# Altium schematic sheet main.SchDoc
size 209 x 297 mm; Address1: Address1; Address2: Address2; Address3: Address3; Address4: Address4; SheetNumber: 1; SheetTotal: 1; Scale: 1:1; Разраб.: Михаил Каа; Обозначение документа: ZX_CARTRIDGE.002 Э3; Номер листа: 1; Общее количество листов: 1; Наименование организации: Михаил Каа; Наименование изделия 1: zx cartridge (Дельта); Наименование изделия 2: Схема электрическая; Наименование изделия 3: принципиальная; Нач. отд.: Нач. отд.
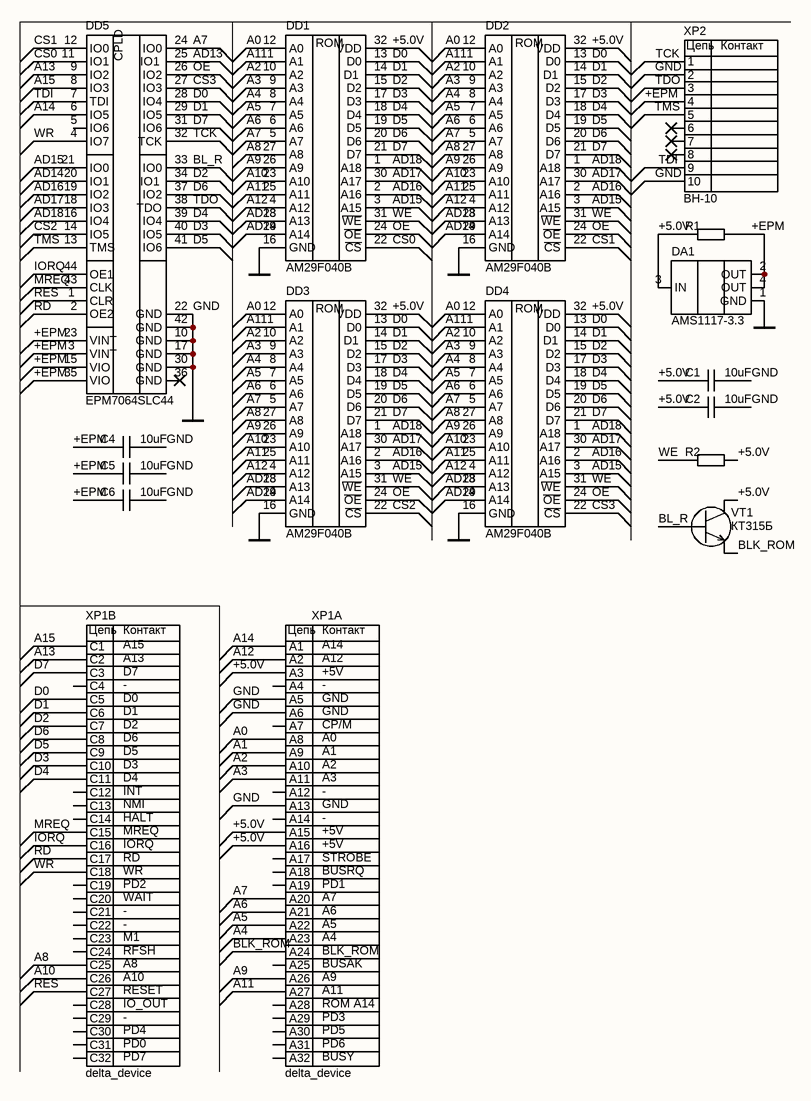
[diagram p0: main.SchDoc]

## Parts
C1  10uF  [C0805]
C2  10uF  [C0805]
C4  10uF  [C0805]
C5  10uF  [C0805]
C6  10uF  [C0805]
DA1  AMS1117-3.3  [SOT229P700X180-4N]
DD1  AM29F040B  [DIP254P1524X482-32]
DD2  AM29F040B  [DIP254P1524X482-32]
DD3  AM29F040B  [DIP254P1524X482-32]
DD4  AM29F040B  [DIP254P1524X482-32]
DD5  EPM7064SLC44  [PLCC-44-R]
R1  0 Ом  [R0603]  (value not drawn)
R2  1 кОм  [R0603]  (value not drawn)
VT1  КТ315Б  [KT-13]
XP1  delta_device  [delta-device]  (parts A,B of 2)
XP2  BH-10  [BH-10]

## Nets
GND: C1.2 C2.2 C4.2 C5.2 C6.2 DA1.1(GND) DD1.16(GND) DD2.16(GND) DD3.16(GND) DD4.16(GND) DD5.10(GND) DD5.17(GND) DD5.22(GND) DD5.30(GND) DD5.42(GND) XP1.A5 XP1.A6 XP1.A13 XP2.2 XP2.10
+5.0V: C1.1 C2.1 DA1.3(IN) DD1.32(VDD) DD2.32(VDD) DD3.32(VDD) DD4.32(VDD) R1.1 R2.2 VT1.2(C) XP1.A3 XP1.A15 XP1.A16
+EPM: C4.1 C5.1 C6.1 DA1.2(OUT) DA1.4(OUT) DD5.3(VINT) DD5.15(VIO) DD5.23(VINT) DD5.35(VIO) R1.2 XP2.4
A0: DD1.12(A0) DD2.12(A0) DD3.12(A0) DD4.12(A0) XP1.A8
A1: DD1.11(A1) DD2.11(A1) DD3.11(A1) DD4.11(A1) XP1.A9
A2: DD1.10(A2) DD2.10(A2) DD3.10(A2) DD4.10(A2) XP1.A10
A3: DD1.9(A3) DD2.9(A3) DD3.9(A3) DD4.9(A3) XP1.A11
A4: DD1.8(A4) DD2.8(A4) DD3.8(A4) DD4.8(A4) XP1.A23
A5: DD1.7(A5) DD2.7(A5) DD3.7(A5) DD4.7(A5) XP1.A22
A6: DD1.6(A6) DD2.6(A6) DD3.6(A6) DD4.6(A6) XP1.A21
A7: DD1.5(A7) DD2.5(A7) DD3.5(A7) DD4.5(A7) DD5.24(IO0) XP1.A20
A8: DD1.27(A8) DD2.27(A8) DD3.27(A8) DD4.27(A8) XP1.C25
A9: DD1.26(A9) DD2.26(A9) DD3.26(A9) DD4.26(A9) XP1.A26
A10: DD1.23(A10) DD2.23(A10) DD3.23(A10) DD4.23(A10) XP1.C26
A11: DD1.25(A11) DD2.25(A11) DD3.25(A11) DD4.25(A11) XP1.A27
A12: DD1.4(A12) DD2.4(A12) DD3.4(A12) DD4.4(A12) XP1.A2
A13: DD5.9(IO2) XP1.C2
A14: DD5.6(IO5) XP1.A1
A15: DD5.8(IO3) XP1.C1
AD13: DD1.28(A13) DD2.28(A13) DD3.28(A13) DD4.28(A13) DD5.25(IO1)
AD14: DD1.29(A14) DD2.29(A14) DD3.29(A14) DD4.29(A14) DD5.20(IO1)
AD15: DD1.3(A15) DD2.3(A15) DD3.3(A15) DD4.3(A15) DD5.21(IO0)
AD16: DD1.2(A16) DD2.2(A16) DD3.2(A16) DD4.2(A16) DD5.19(IO2)
AD17: DD1.30(A17) DD2.30(A17) DD3.30(A17) DD4.30(A17) DD5.18(IO3)
AD18: DD1.1(A18) DD2.1(A18) DD3.1(A18) DD4.1(A18) DD5.16(IO4)
BL_R: DD5.33(IO0) VT1.3(B)
BLK_ROM: VT1.1(E) XP1.A24
CS0: DD1.22(~{CS}) DD5.11(IO1)
CS1: DD2.22(~{CS}) DD5.12(IO0)
CS2: DD3.22(~{CS}) DD5.14(IO5)
CS3: DD4.22(~{CS}) DD5.27(IO3)
D0: DD1.13(D0) DD2.13(D0) DD3.13(D0) DD4.13(D0) DD5.28(IO4) XP1.C5
D1: DD1.14(D1) DD2.14(D1) DD3.14(D1) DD4.14(D1) DD5.29(IO5) XP1.C6
D2: DD1.15(D2) DD2.15(D2) DD3.15(D2) DD4.15(D2) DD5.34(IO1) XP1.C7
D3: DD1.17(D3) DD2.17(D3) DD3.17(D3) DD4.17(D3) DD5.40(IO5) XP1.C10
D4: DD1.18(D4) DD2.18(D4) DD3.18(D4) DD4.18(D4) DD5.39(IO4) XP1.C11
D5: DD1.19(D5) DD2.19(D5) DD3.19(D5) DD4.19(D5) DD5.41(IO6) XP1.C9
D6: DD1.20(D6) DD2.20(D6) DD3.20(D6) DD4.20(D6) DD5.37(IO2) XP1.C8
D7: DD1.21(D7) DD2.21(D7) DD3.21(D7) DD4.21(D7) DD5.31(IO6) XP1.C3
IORQ: DD5.44(OE1) XP1.C16
MREQ: DD5.43(CLK) XP1.C15
OE: DD1.24(~{OE}) DD2.24(~{OE}) DD3.24(~{OE}) DD4.24(~{OE}) DD5.26(IO2)
RD: DD5.2(OE2) XP1.C17
RES: DD5.1(CLR) XP1.C27
TCK: DD5.32(TCK) XP2.1
TDI: DD5.7(TDI) XP2.9
TDO: DD5.38(TDO) XP2.3
TMS: DD5.13(TMS) XP2.5
WE: DD1.31(~{WE}) DD2.31(~{WE}) DD3.31(~{WE}) DD4.31(~{WE}) R2.1
WR: DD5.4(IO7) XP1.C18

Not connected (* = marked no-connect by the designer): DD5 5(IO6) 36(GND)*; XP1 A4 A7 A12 A14 A17 A18 A19 A25 A28 A29 A30 A31 A32 C4 C12 C13 C14 C19 C20 C21 C22 C23 C24 C28 C29 C30 C31 C32; XP2 6* 7* 8*

## Notes on the sheet
- Перв. примен.
- Справ. №
- Подп. и дата
- Инв. № дубл.
- Взам. инв. №
- Разраб.
- Изм.
- Лист
- № докум.
- Подп.
- Лит.
- Масса
- Масштаб
- Пров.
- Т.контр.
- Листов
- Инв. № подл.
- Утв.
- Н.контр.
- Копировал
- Формат А4
- (in symbol AM29F040B) ROM
- (in symbol BH-10) Цепь; Контакт
- (in symbol delta_device, part A) Цепь; Контакт; +5V; -; GND; CP/M; A0; STROBE; BUSRQ; PD1; BLK_ROM; BUSAK; ROM A14; PD3; PD5; PD6; BUSY
- (in symbol delta_device, part B) Цепь; Контакт; D7; -; D0; D1; D2; D6; D5; D3; D4; INT; NMI; HALT; MREQ; IORQ; RD; WR; PD2; WAIT; M1; RFSH; RESET; IO_OUT; PD4; PD0; PD7
- (in symbol EPM7064SLC44) CPLD

## Library data of the parts
C1 C2 C4-C6 = CapCer
DD5 = EPM7064SLC44: 44-Pin PLCC44
R1 R2 = Res
VT1 = КТ315Б: NPN Transistor
XP2 = BH-10: 10 Position Total Dual Row 2.54 mm Pitch Straight Male Shrouded Box Header; MF: Sullins Connector; MP: SBH11-PBPC-D05-ST-BK; SnapEDA_Link: https://www.snapeda.com/parts/SBH11-PBPC-D05-ST-BK/Sullins+Connector+Solutions/view-part/?ref=snap; Package: None; Value: *; Check_prices: https://www.snapeda.com/parts/SBH11-PBPC-D05-ST-BK/Sullins+Connector+Solutions/view-part/?ref=eda
XP1 = delta_device: Value: *